# Altium schematic sheet Sheet6.SchDoc
size A4; SheetNumber: 6; SheetTotal: 6
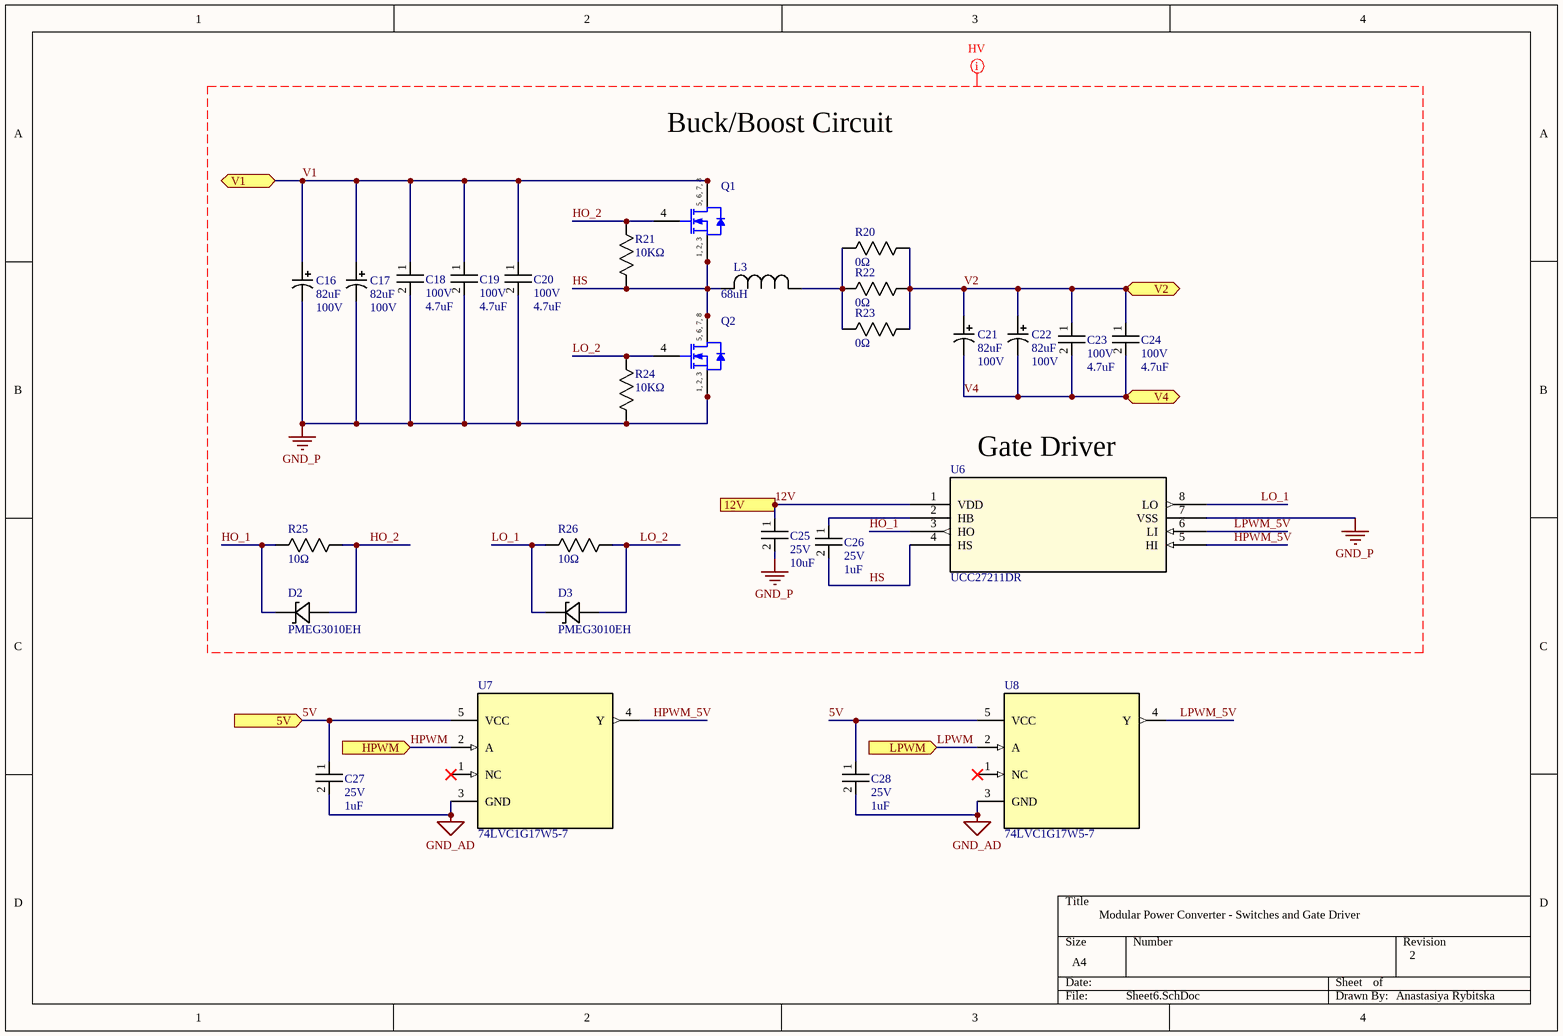
[diagram p0: Sheet6.SchDoc]

## Parts
C16  Capacitance: 82uF  Voltage Rating: 100V  [CAP_YX_10X16_RUB]  (hidden comment: 100ZLJ82M10X16)
C17  Capacitance: 82uF  Voltage Rating: 100V  [CAP_YX_10X16_RUB]  (hidden comment: 100ZLJ82M10X16)
C18  Voltage Rating: 100V  Capacitance: 4.7uF  [0805]  (hidden comment: C2012X5R2A475K125AC)
C19  Voltage Rating: 100V  Capacitance: 4.7uF  [0805]  (hidden comment: C2012X5R2A475K125AC)
C20  Voltage Rating: 100V  Capacitance: 4.7uF  [0805]  (hidden comment: C2012X5R2A475K125AC)
C21  Capacitance: 82uF  Voltage Rating: 100V  [CAP_YX_10X16_RUB]  (hidden comment: 100ZLJ82M10X16)
C22  Capacitance: 82uF  Voltage Rating: 100V  [CAP_YX_10X16_RUB]  (hidden comment: 100ZLJ82M10X16)
C23  Voltage Rating: 100V  Capacitance: 4.7uF  [0805]  (hidden comment: GRM21BD72A225ME01L)
C24  Voltage Rating: 100V  Capacitance: 4.7uF  [0805]  (hidden comment: GRM21BD72A225ME01L)
C25  Voltage Rating: 25V  Capacitance: 10uF  [0805]  (hidden comment: TMK212BBJ106KG-T)
C26  Voltage Rating: 25V  Capacitance: 1uF  [0603]  (hidden comment: CL10B105KA8NFNC)
C27  Voltage Rating: 25V  Capacitance: 1uF  [0603]  (hidden comment: CL10B105KA8NFNC)
C28  Voltage Rating: 25V  Capacitance: 1uF  [0603]  (hidden comment: CL10B105KA8NFNC)
D2  PMEG3010EH  [SOD123F_NXP]
D3  PMEG3010EH  [SOD123F_NXP]
L3  Inductance: 68uH  [IND_PA4349.683ANLT_PUL]  (hidden comment: PA4349.683ANLT)
Q1  TPH9R00CQH,LQ  [INF-PG-TDSON-8-1_V]  (value not drawn)
Q2  TPH9R00CQH,LQ  [INF-PG-TDSON-8-1_V]  (value not drawn)
R20  Resistance: 0Ω  [0603]  (hidden comment: AC0603FR-070RL)
R21  Resistance: 10KΩ  [0603]  (hidden comment: RNCP0603FTD10K0)
R22  Resistance: 0Ω  [0603]  (hidden comment: AC0603FR-070RL)
R23  Resistance: 0Ω  [0603]  (hidden comment: AC0603FR-070RL)
R24  Resistance: 10KΩ  [0603]  (hidden comment: RNCP0603FTD10K0)
R25  Resistance: 10Ω  [0603]  (hidden comment: RMCF0603JT10R0)
R26  Resistance: 10Ω  [0603]  (hidden comment: RMCF0603JT10R0)
U6  UCC27211DR  [D8]
U7  74LVC1G17W5-7  [SOT95P280X145-5N]
U8  74LVC1G17W5-7  [SOT95P280X145-5N]

## Ports
5V (in), 12V (in), HPWM (in), LPWM (in), V1 (bidir), V2 (bidir), V4 (bidir)

## Nets
GND_AD: C27.2 C28.2 U7.3(GND) U8.3(GND)
GND_P: C16.2 C17.2 C18.2 C19.2 C20.2 C25.2 Q2.1(SOURCE) Q2.2(SOURCE) Q2.3(SOURCE) R24.1 U6.7(VSS)
5V: C27.1 C28.1 U7.5(VCC) U8.5(VCC) ; port 5V
12V: C25.1 U6.1(VDD) ; port 12V
HO_1: D2.1 R25.1 U6.3(HO)
HO_2: D2.2 Q1.4(GATE) R21.2 R25.2
HPWM: U7.2(A) ; port HPWM
HPWM_5V: U6.5(HI) U7.4(Y)
HS: C26.2 L3.2 Q1.1(SOURCE) Q1.2(SOURCE) Q1.3(SOURCE) Q2.5(DRAIN) Q2.6(DRAIN) Q2.7(DRAIN) Q2.8(DRAIN) R21.1 U6.4(HS)
LO_1: D3.1 R26.1 U6.8(LO)
LO_2: D3.2 Q2.4(GATE) R24.2 R26.2
LPWM: U8.2(A) ; port LPWM
LPWM_5V: U6.6(LI) U8.4(Y)
V1: C16.1 C17.1 C18.1 C19.1 C20.1 Q1.5(DRAIN) Q1.6(DRAIN) Q1.7(DRAIN) Q1.8(DRAIN) ; port V1
V2: C21.1 C22.1 C23.1 C24.1 R20.2 R22.2 R23.2 ; port V2
V4: C21.2 C22.2 C23.2 C24.2 ; port V4
NetC26_1: C26.1 U6.2(HB)
NetL3_1: L3.1 R20.1 R22.1 R23.1

Not connected (* = marked no-connect by the designer): U7 1(NC)*; U8 1(NC)*

## Layout directives
rule Clearance Constraint [Clearance = 0.6mm]: 12V, GND_P, HO_1, HO_2, HPWM_5V, HS, LO_1, LO_2, LPWM_5V, V1, V2, V4

## Notes on the sheet
- Buck/Boost Circuit
- (near U6) Gate Driver
- Modular Power Converter - Switches and Gate Driver
- 2
- Anastasiya Rybitska
- (in symbol CMP-1091-00070-1) 5, 6, 7, 8; 1, 2, 3

## Library data of the parts
C16 C17 C21 C22 = 100ZLJ82M10X16: No Description Available; Mfr_Name: Rubycon; Type: DEV; Copyright: Copyright (C) 2022 Ultra Librarian. All rights reserved.; Manufacturer_Part_Number: 100ZLJ82M10X16; Digi-Key_Part_Number_1: 1189-1049-ND; RefDes: RefDes
C18-C20 = GRM21BD72A225ME01L: CAP CER 4.7UF 100V X5R 0805
C23 C24 = GRM21BD72A225ME01L: CAP CER 2.2UF 100V X7T 0805
C25 = TMK212BBJ106KG-T: Multilayer Ceramic Capacitor 10uF 25V X5R 10% SMD 0805 T/R
C26-C28 = CL10B105KA8NFNC: Cap Ceramic 1uF 25V X7R ±10% Pad SMD 0603 +125°C T/R
D2 D3 = PMEG3010EH: No Description Available; Mfr_Name: NXP; Type: DEV; Copyright: Copyright (C) 2022 Ultra Librarian. All rights reserved.; Manufacturer_Part_Number: PMEG3010EH; Digi-Key_Part_Number_1: 568-4125-2-ND; Digi-Key_Part_Number_2: 568-4125-1-ND; Digi-Key_Part_Number_3: 568-4125-6-ND; RefDes: RefDes
L3 = PA4349.683ANLT: No Description Available; Mfr_Name: Pulse Electronics Corporation; Copyright: Copyright (C) 2022 Ultra Librarian. All rights reserved.; Manufacturer_Part_Number: PA4349.683ANLT
Q1 Q2 = CMP-1091-00070-1: N-Channel 150 V 64A (Tc) 960mW (Ta), 210W (Tc) Surface Mount 8-SOP Advance (5x5); Manufacturer: Infineon; PartNumber: BSC240N12NS3 G; IDpuls (max): 148Â A; RDS (on) (max): 24Â mOhm; VGS(th) (min): 2Â V; RthJA (max): 50Â K/W; Green: TRUE; RthJC (max): 1.9 K/W; Ptot (max): 66Â W; VDS (max): 120Â V; Polarity: N; QG: 20Â nC; VGS(th) (max): 4Â V; ID (max): 37Â A; Packing: Reel; Rth: 1.9Â K/W; ComponentLink3Description: Package Specification; ComponentLink2Description: Datasheet; Halogen-free: TRUE; PackageDescription: 8-Pin Plastic (Green) Thin Dual Small Outline Non-Leaded Package, 5.15 x 5.9 mm Body, 1.27 mm Pitch; DatasheetVersion: Rev. 2.0; ComponentLink2URL: http://www.infineon.com/dgdl/BSC240N12NS3+Rev2.pdf?folderId=db3a304313b8b5a60113cee8763b02d7&fileId=db3a30432a40a650012a42e6a9060027; ComponentLink3URL: http://www.infineon.com/cms/packages/SMD_-_Surface_Mounted_Devices/P-PG-TDSON/P-PG-TDSON-08-01x_2x_3.html?__locale=en; Mounting Technology: Surface Mount; ComponentLink1Description: Manufacturer URL; PackageReference: PG-TDSON-8-1; ComponentLink1URL: http://www.infineon.com/
R20 R22 R23 = AC0603FR-070RL: RES SMD 0 OHM JUMPER 1/10W 0603
R21 R24 = RNCP0603FTD10K0: 10kΩ ±1% 0.125W 0603 High Power Anti-Sulfur Thin Film Chip Resistor
R25 R26 = RMCF0603JT10R0: RES 10 OHM 5% 1/10W 0603
U6 = UCC27210D: IC GATE DRVR HALF-BRIDGE 8SOIC; Mfr_Name: Texas Instruments; Copyright: Copyright (C) 2022 Ultra Librarian. All rights reserved.; Manufacturer_Part_Number: UCC27210D; Digi-Key_Part_Number_1: 296-30015-5-ND; Digi-Key_Part_Number_2: 2156-UCC27210D-ND; RefDes: RefDes; Type: DEV
U7 U8 = 74LVC1G17W5-7: Buffer, Non-Inverting 1 Element 1 Bit per Element Push-Pull Output SOT-25; MF: Diodes Inc.; Digi-Key_Part_Number: 74LVC1G17W5-7CT-ND; Mouser-Purchase-URL: https://snapeda.com/shop?store=Mouser&id=277150; MP: 74LVC1G17W5-7; DigiKey-Purchase-URL: https://snapeda.com/shop?store=DigiKey&id=277150; Package: SOT-753 Diodes Inc.; SnapEDA_Link: https://www.snapeda.com/parts/74LVC1G17W5-7/Diodes%20Inc./view-part/277150/?ref=snap; Value: *